# EAGLE design testbench (EAGLE 6.6.0)
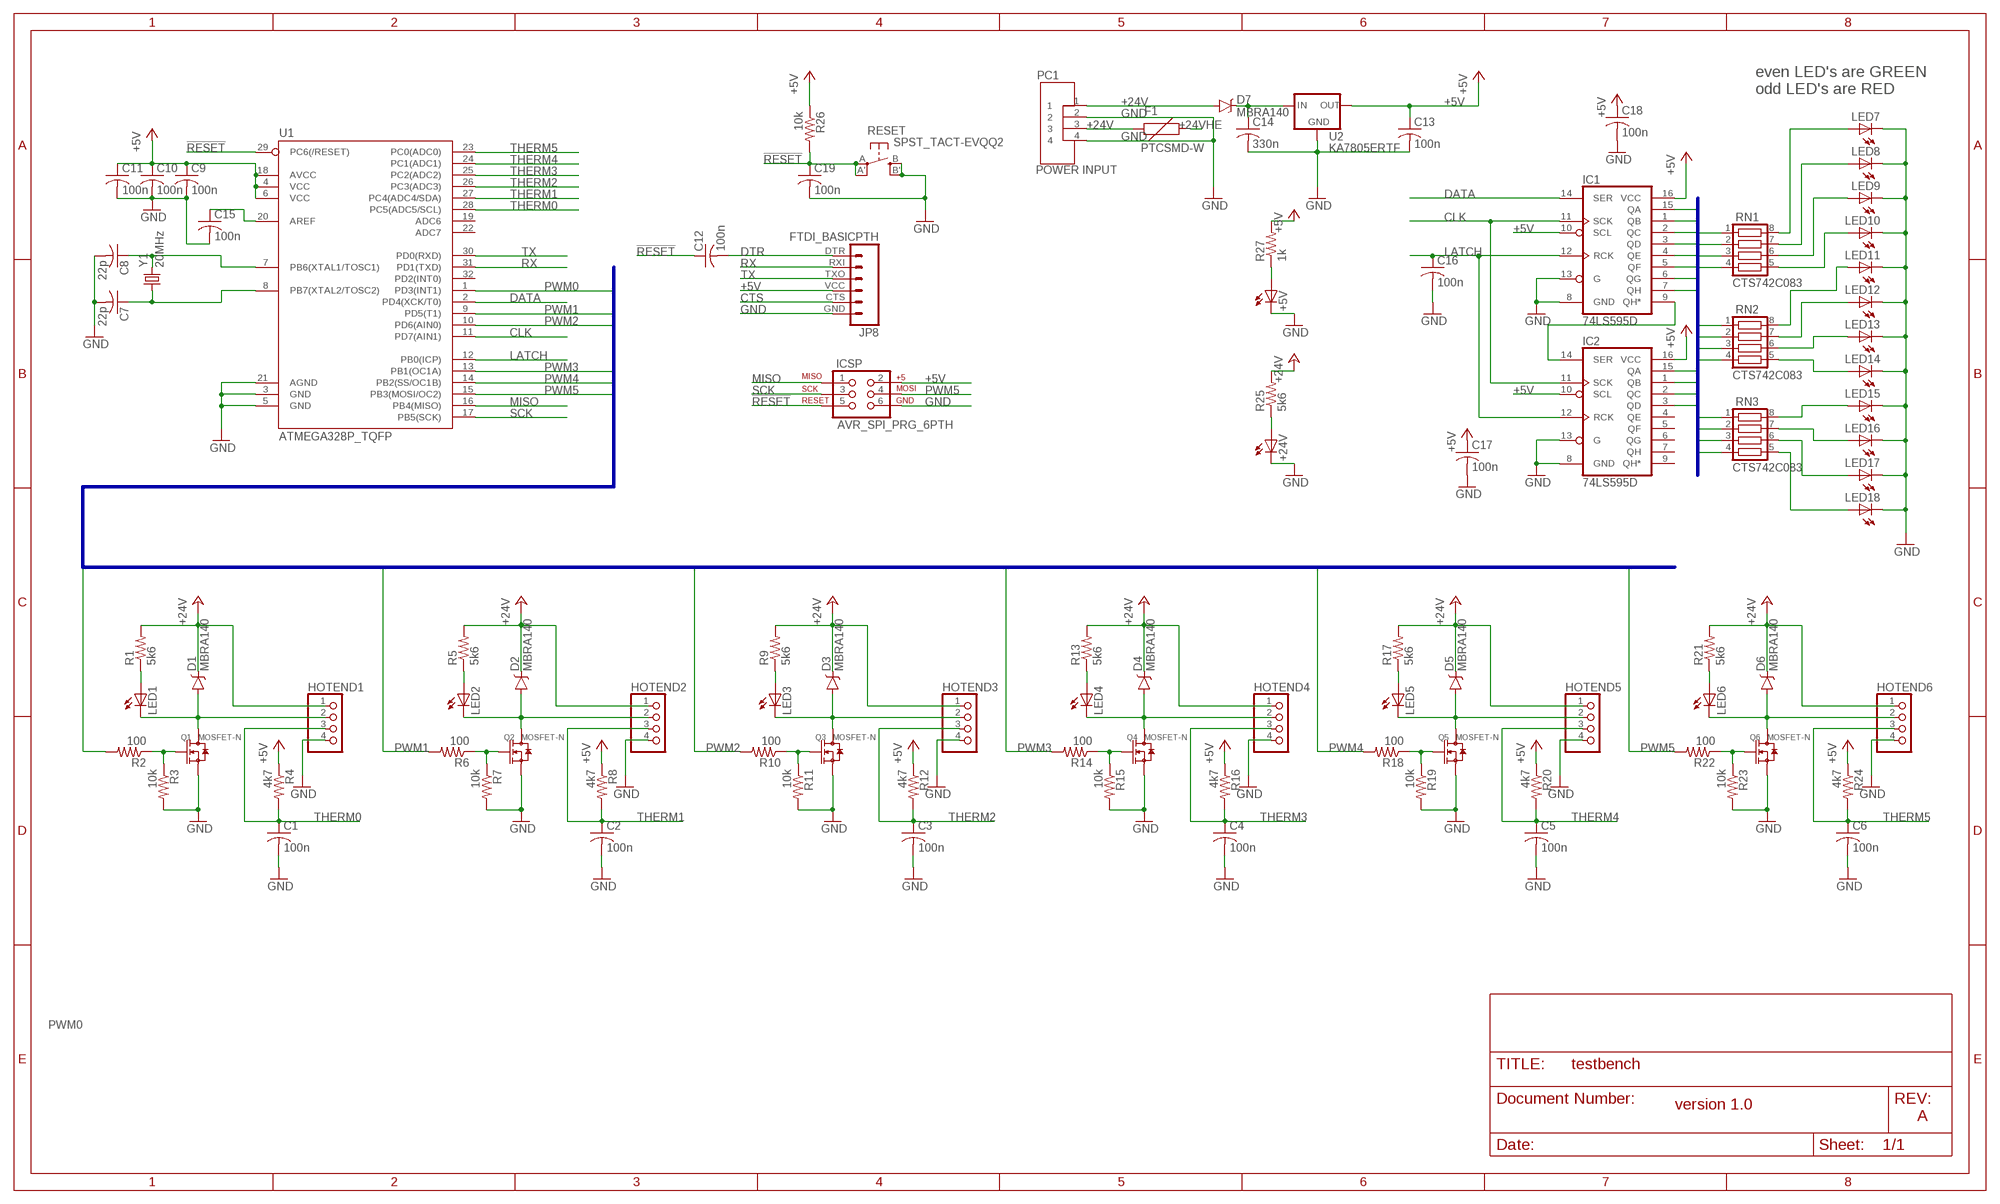
[diagram p0: schematic, sheet 1]

## Parts
+5V  LEDCHIP-LED0805  [CHIP-LED0805]
+24V  LEDCHIP-LED0805  [CHIP-LED0805]
C1  100n  C-USC0805K  [C0805K]
C2  100n  C-USC0805K  [C0805K]
C3  100n  C-USC0805K  [C0805K]
C4  100n  C-USC0805K  [C0805K]
C5  100n  C-USC0805K  [C0805K]
C6  100n  C-USC0805K  [C0805K]
C7  22p  C-USC0805K  [C0805K]
C8  22p  C-USC0805K  [C0805K]
C9  100n  C-USC0805K  [C0805K]
C10  100n  C-USC0805K  [C0805K]
C11  100n  C-USC0805K  [C0805K]
C12  100n  C-USC0805K  [C0805K]
C13  100n  C-USC0805K  [C0805K]
C14  330n  C-USC0805K  [C0805K]
C15  100n  C-USC0805K  [C0805K]
C16  100n  C-USC0805K  [C0805K]
C17  100n  C-USC0805K  [C0805K]
C18  100n  C-USC0805K  [C0805K]
C19  100n  C-USC0805K  [C0805K]
D1  MBRA140  [SMA-DIODE]
D2  MBRA140  [SMA-DIODE]
D3  MBRA140  [SMA-DIODE]
D4  MBRA140  [SMA-DIODE]
D5  MBRA140  [SMA-DIODE]
D6  MBRA140  [SMA-DIODE]
D7  MBRA140  [SMA-DIODE]
F1  PTCSMD-W  [PTC-1206-WIDE]
HOTEND1  PINHD-1X4  [1X04]
HOTEND2  PINHD-1X4  [1X04]
HOTEND3  PINHD-1X4  [1X04]
HOTEND4  PINHD-1X4  [1X04]
HOTEND5  PINHD-1X4  [1X04]
HOTEND6  PINHD-1X4  [1X04]
IC1  74LS595D  [SO16]
IC2  74LS595D  [SO16]
ICSP  AVR_SPI_PRG_6PTH  [2X3]
JP8  FTDI_BASICPTH  [FTDI_BASIC]
LED1  LEDCHIP-LED0805  [CHIP-LED0805]
LED2  LEDCHIP-LED0805  [CHIP-LED0805]
LED3  LEDCHIP-LED0805  [CHIP-LED0805]
LED4  LEDCHIP-LED0805  [CHIP-LED0805]
LED5  LEDCHIP-LED0805  [CHIP-LED0805]
LED6  LEDCHIP-LED0805  [CHIP-LED0805]
LED7  LEDCHIP-LED0805  [CHIP-LED0805]
LED8  LEDCHIP-LED0805  [CHIP-LED0805]
LED9  LEDCHIP-LED0805  [CHIP-LED0805]
LED10  LEDCHIP-LED0805  [CHIP-LED0805]
LED11  LEDCHIP-LED0805  [CHIP-LED0805]
LED12  LEDCHIP-LED0805  [CHIP-LED0805]
LED13  LEDCHIP-LED0805  [CHIP-LED0805]
LED14  LEDCHIP-LED0805  [CHIP-LED0805]
LED15  LEDCHIP-LED0805  [CHIP-LED0805]
LED16  LEDCHIP-LED0805  [CHIP-LED0805]
LED17  LEDCHIP-LED0805  [CHIP-LED0805]
LED18  LEDCHIP-LED0805  [CHIP-LED0805]
PC1  POWER INPUT  POWER_CONNECTOR_4WAY  [MOLEX_MINIFIT-JR]
Q1  MOSFET-N  [SOIC8]
Q2  MOSFET-N  [SOIC8]
Q3  MOSFET-N  [SOIC8]
Q4  MOSFET-N  [SOIC8]
Q5  MOSFET-N  [SOIC8]
Q6  MOSFET-N  [SOIC8]
R1  5k6  R-US_R0805  [R0805]
R2  100  R-US_R0805  [R0805]
R3  10k  R-US_R0805  [R0805]
R4  4k7  R-US_R0805  [R0805]
R5  5k6  R-US_R0805  [R0805]
R6  100  R-US_R0805  [R0805]
R7  10k  R-US_R0805  [R0805]
R8  4k7  R-US_R0805  [R0805]
R9  5k6  R-US_R0805  [R0805]
R10  100  R-US_R0805  [R0805]
R11  10k  R-US_R0805  [R0805]
R12  4k7  R-US_R0805  [R0805]
R13  5k6  R-US_R0805  [R0805]
R14  100  R-US_R0805  [R0805]
R15  10k  R-US_R0805  [R0805]
R16  4k7  R-US_R0805  [R0805]
R17  5k6  R-US_R0805  [R0805]
R18  100  R-US_R0805  [R0805]
R19  10k  R-US_R0805  [R0805]
R20  4k7  R-US_R0805  [R0805]
R21  5k6  R-US_R0805  [R0805]
R22  100  R-US_R0805  [R0805]
R23  10k  R-US_R0805  [R0805]
R24  4k7  R-US_R0805  [R0805]
R25  5k6  R-US_R0805  [R0805]
R26  10k  R-US_R0805  [R0805]
R27  1k  R-US_R0805  [R0805]
RESET  SPST_TACT-EVQQ2  [EVQ-Q2]
RN1  CTS742C083  [CTS742C083]
RN2  CTS742C083  [CTS742C083]
RN3  CTS742C083  [CTS742C083]
U1  ATMEGA328P_TQFP  [TQFP32-08]
U2  KA7805ERTF  V_REG_78XX7812  [TO-252]
Y1  20MHz  CRYSTALHC49US  [HC49US]

## Nets
!RESET: C12.1 C19.1 ICSP.5 R26.2 RESET.A'(P1) RESET.A(P) U1.29(PC6(/RESET))
+5V: C9.1 C10.1 C11.1 C13.1 C17.1 C18.1 IC1.10(SCL) IC1.16(VCC) IC2.10(SCL) IC2.16(VCC) ICSP.2 JP8.VCC R4.1 R8.1 R12.1 R16.1 R20.1 R24.1 R26.1 R27.2 U1.4(VCC) U1.6(VCC) U1.18(AVCC) U2.2(OUT)
+24V: D7.A F1.1 PC1.1 PC1.3 R25.2
+24VHE: D1.C D2.C D3.C D4.C D5.C D6.C F1.2 HOTEND1.1 HOTEND2.1 HOTEND3.1 HOTEND4.1 HOTEND5.1 HOTEND6.1 R1.2 R5.2 R9.2 R13.2 R17.2 R21.2 ; supply symbol labelled +24V
CLK: IC1.11(SCK) IC2.11(SCK) U1.11(PD7(AIN1))
CTS: JP8.CTS
DATA: IC1.14(SER) U1.2(PD4(XCK/T0))
DTR: C12.2 JP8.DTR
GND: +5V.C +24V.C C1.2 C2.2 C3.2 C4.2 C5.2 C6.2 C7.2 C8.2 C9.2 C10.2 C11.2 C13.2 C14.2 C15.2 C16.2 C17.2 C18.2 C19.2 HOTEND1.4 HOTEND2.4 HOTEND3.4 HOTEND4.4 HOTEND5.4 HOTEND6.4 IC1.8(GND) IC1.13(G) IC2.8(GND) IC2.13(G) ICSP.6 JP8.GND LED7.C LED8.C LED9.C LED10.C LED11.C LED12.C LED13.C LED14.C LED15.C LED16.C LED17.C LED18.C PC1.2 PC1.4 Q1.1(S) Q1.2(S) Q1.3(S) Q2.1(S) Q2.2(S) Q2.3(S) Q3.1(S) Q3.2(S) Q3.3(S) Q4.1(S) Q4.2(S) Q4.3(S) Q5.1(S) Q5.2(S) Q5.3(S) Q6.1(S) Q6.2(S) Q6.3(S) R3.2 R7.2 R11.2 R15.2 R19.2 R23.2 RESET.B'(S1) RESET.B(S) U1.3(GND) U1.5(GND) U1.21(AGND) U2.3(GND)
H1: D1.A HOTEND1.2 LED1.C Q1.5(D) Q1.6(D) Q1.7(D) Q1.8(D)
H2: D2.A HOTEND2.2 LED2.C Q2.5(D) Q2.6(D) Q2.7(D) Q2.8(D)
H3: D3.A HOTEND3.2 LED3.C Q3.5(D) Q3.6(D) Q3.7(D) Q3.8(D)
H4: D4.A HOTEND4.2 LED4.C Q4.5(D) Q4.6(D) Q4.7(D) Q4.8(D)
H5: D5.A HOTEND5.2 LED5.C Q5.5(D) Q5.6(D) Q5.7(D) Q5.8(D)
H6: D6.A HOTEND6.2 LED6.C Q6.5(D) Q6.6(D) Q6.7(D) Q6.8(D)
LATCH: C16.1 IC1.12(RCK) IC2.12(RCK) U1.12(PB0(ICP))
LED0: IC1.15(QA) RN2.4
LED1: IC1.1(QB) RN2.3
LED2: IC1.2(QC) RN2.2
LED3: IC1.3(QD) RN2.1
LED4: IC1.4(QE) RN1.4
LED5: IC1.5(QF) RN1.3
LED6: IC1.6(QG) RN1.2
LED7: IC1.7(QH) RN1.1
LED8: IC2.15(QA) RN3.4
LED9: IC2.1(QB) RN3.3
LED10: IC2.2(QC) RN3.2
LED11: IC2.3(QD) RN3.1
MISO: ICSP.1 U1.16(PB4(MISO))
N$1: Q1.4(G) R2.1 R3.1
N$2: +24V.A R25.1
N$3: LED1.A R1.1
N$4: Q5.4(G) R18.1 R19.1
N$5: C7.1 U1.8(PB7(XTAL2/TOSC2)) Y1.1
N$6: LED7.A RN1.8
N$8: Q2.4(G) R6.1 R7.1
N$10: LED2.A R5.1
N$11: Q3.4(G) R10.1 R11.1
N$13: LED3.A R9.1
N$14: Q4.4(G) R14.1 R15.1
N$16: LED4.A R13.1
N$17: LED5.A R17.1
N$18: Q6.4(G) R22.1 R23.1
N$20: LED6.A R21.1
N$21: C8.1 U1.7(PB6(XTAL1/TOSC1)) Y1.2
N$22: C15.1 U1.20(AREF)
N$23: C14.1 D7.C U2.1(IN)
N$24: LED8.A RN1.7
N$25: LED9.A RN1.6
N$26: LED10.A RN1.5
N$27: LED11.A RN2.8
N$28: LED12.A RN2.7
N$29: LED13.A RN2.6
N$30: LED14.A RN2.5
N$31: LED15.A RN3.8
N$32: LED16.A RN3.7
N$33: LED17.A RN3.6
N$34: LED18.A RN3.5
N$35: IC1.9(QH*) IC2.14(SER)
N$36: +5V.A R27.1
PWM0: R2.2 U1.1(PD3(INT1))
PWM1: R6.2 U1.9(PD5(T1))
PWM2: R10.2 U1.10(PD6(AIN0))
PWM3: R14.2 U1.13(PB1(OC1A))
PWM4: R18.2 U1.14(PB2(SS/OC1B))
PWM5: ICSP.4 R22.2 U1.15(PB3(MOSI/OC2))
RX: JP8.RXI U1.31(PD1(TXD))
SCK: ICSP.3 U1.17(PB5(SCK))
THERM0: C1.1 HOTEND1.3 R4.2 U1.28(PC5(ADC5/SCL))
THERM1: C2.1 HOTEND2.3 R8.2 U1.27(PC4(ADC4/SDA))
THERM2: C3.1 HOTEND3.3 R12.2 U1.26(PC3(ADC3))
THERM3: C4.1 HOTEND4.3 R16.2 U1.25(PC2(ADC2))
THERM4: C5.1 HOTEND5.3 R20.2 U1.24(PC1(ADC1))
THERM5: C6.1 HOTEND6.3 R24.2 U1.23(PC0(ADC0))
TX: JP8.TXO U1.30(PD0(RXD))
Unconnected: IC2.4(QE) IC2.5(QF) IC2.6(QG) IC2.7(QH) IC2.9(QH*) U1.19(ADC6) U1.22(ADC7) U1.32(PD2(INT0))

## Buses
PWM[0..5]
LED[0..11]

## Notes on the sheet
- even LED's are GREEN
  odd LED's are RED
- version 1.0
- A

## Library data of the parts
+5V +24V LED1-LED18 = led:LED: LED OSRAM: - CHIPLED LG R971, LG N971, LY N971, LG Q971, LY Q971, LO R971, LY R971 LH N974, LH R974 LS Q976, LO Q976, LY Q976 LO Q996 - Hyper CHIPLED LW Q18S LB Q993, LB Q99A, LB R99A - SideLED LS A670, LO A670, LY A670, LG A670, LP A670 LB A673, LV A673, LT A673, LW A673 LH A674 LY A675 LS A676, LA A676, LO A676, LY A676, LW A676 LS A679, LY A679, LG A679 - Hyper Micro SIDELED® LS Y876, LA Y876, LO Y876, LY Y876 LT Y87S - SmartLED LW L88C, LW L88S LB L89C, LB L89S, LG L890 LS L89K, LO L89K, LY L89K LS L896, LA L896, LO L896, LY L896 - TOPLED LS T670, LO T670, LY T670, LG T670, LP T670 LSG T670, LSP T670, LSY T670, LOP T670, LYG T670 LG T671, LOG T671, LSG T671 LB T673, LV T673, LT T673, LW T673 LH T674 LS T676, LA T676, LO T676, LY T676, LB T676, LH T676, LSB T676, LW T676 LB T67C, LV T67C, LT T67C, LS T67K, LO T67K, LY T67K, LW E67C LS E67B, LA E67B, LO E67B, LY E67B, LB E67C, LV E67C, LT E67C LW T67C LS T679, LY T679, LG T679 LS T770, LO T770, LY T770, LG T770, LP T770 LB T773, LV T773, LT T773, LW T773 LH T774 LS E675, LA E675, LY E675, LS T675 LS T776, LA T776, LO T776, LY T776, LB T776 LHGB T686 LT T68C, LB T68C - Hyper Mini TOPLED® LB M676 - Mini TOPLED Santana® LG M470 LS M47K, LO M47K, LY M47K Source: http://www.osram.convergy.de LUXEON: - LUMILED® LXK2-PW12-R00, LXK2-PW12-S00, LXK2-PW14-U00, LXK2-PW14-V00 LXK2-PM12-R00, LXK2-PM12-S00, LXK2-PM14-U00 LXK2-PE12-Q00, LXK2-PE12-R00, LXK2-PE12-S00, LXK2-PE14-T00, LXK2-PE14-U00 LXK2-PB12-K00, LXK2-PB12-L00, LXK2-PB12-M00, LXK2-PB14-N00, LXK2-PB14-P00, LXK2-PB14-Q00 LXK2-PR12-L00, LXK2-PR12-M00, LXK2-PR14-Q00, LXK2-PR14-R00 LXK2-PD12-Q00, LXK2-PD12-R00, LXK2-PD12-S00 LXK2-PH12-R00, LXK2-PH12-S00 LXK2-PL12-P00, LXK2-PL12-Q00, LXK2-PL12-R00 Source: www.luxeon.com KINGBRIGHT: KA-3528ASYC Source: www.kingbright.com; MF: MULTICOMP; MPN: OVS-0803; OC_FARNELL: 1716765
C1-C6 C9-C13 C15-C19 = rcl:C-US: CAPACITOR, American symbol; MF: AVX; MPN: 08051C104KAT2A; OC_FARNELL: 1740681
C7 C8 = rcl:C-US: CAPACITOR, American symbol; MF: AVX; MPN: 08051A220JAT2A; OC_FARNELL: 317500
C14 = rcl:C-US: CAPACITOR, American symbol; MF: AVX; MPN: 08055C334KAT2A; OC_FARNELL: 1657934
D1-D7 = SparkFun-DiscreteSemi:MBRA140: 40V, 1A Schottky rectifier SMA/DO-214AC package DIO-08053; MF: DIODES INC.; MPN: B140-13-F; OC_FARNELL: 1843670; PROD_ID: DIO-08053
F1 = SparkFun-PowerIC:PTC: Resettable Fuse PTC Resettable Fuse. Spark Fun Electronics SKU : COM-08357; MF: SCHURTER; MPN: 3413.0329.22; OC_FARNELL: 1829472
HOTEND1-HOTEND6 = pinhead:PINHD-1X4: PIN HEADER; OC_FARNELL: unknown
IC1 IC2 = SparkFun-DigitalIC:74*595: 8-bit SHIFT REGISTER, output latch; MF: TEXAS INSTRUMENTS; MPN: SN74AHCT595D; OC_FARNELL: 1740114; PROD_ID: IC-07875
ICSP = SparkFun-Connectors:AVR_SPI_PRG_6: AVR ISP 6 Pin This is the reduced ISP connector for AVR programming. Common on Arduino. This footprint will take up less PCB space and can be used with a 10-pin to 6-pin adapter such as SKU: BOB-08508 **Special note about "TEST_POINT" package. The stop mask is on the top side, so if you want your programming test points to be on the bottom of your board, make sure to place this package on the bottom side of the board. This also ensure that the orientation to program from the bottom side will be correct.; OC_FARNELL: unknown
JP8 = SparkFun-Connectors:FTDI_BASIC: FTDI Basic header with labels; OC_FARNELL: unknown
PC1 = MarcEagleParts:POWER_CONNECTOR_4WAY: MOLEX Mini-Fit Jr. 13A/600V Power connector REF: 39303045 Farnell --> 9963553; MF: MOLEX; MPN: 39303045; OC_FARNELL: 9963553
Q1-Q6 = MarcEagleParts:MOSFET-N: CJ2302：SMD MOSFET N-CH 20V-2.1A; MF: INTERNATIONAL RECTIFIER; MPN: IRF8736PBF; OC_FARNELL: 1551903
R1 R5 R9 R13 R17 R21 R25 = rcl:R-US_: RESISTOR, American symbol; MF: MULTICOMP; MPN: MCWR08X5601FTL; OC_FARNELL: 2447693
R2 R6 R10 R14 R18 R22 = rcl:R-US_: RESISTOR, American symbol; MF: PANASONIC ELECTRONIC COMPONENTS; MPN: ERA6AEB101V; OC_FARNELL: 1577644
R3 R7 R11 R15 R19 R23 R26 = rcl:R-US_: RESISTOR, American symbol; MF: BOURNS; MPN: 0621-013K500-AB103; OC_FARNELL: 2469474
R4 R8 R12 R16 R20 R24 = rcl:R-US_: RESISTOR, American symbol; MF: TE CONNECTIVITY; MPN: 1-2176085-7; OC_FARNELL: 2118118
R27 = rcl:R-US_: RESISTOR, American symbol; MF: BOURNS; MPN: CR0805-JW-102ELF; OC_FARNELL: 2008389
RESET = adafruit:SPST_TACT: SMT 6mm switch, EVQQ2 series http://www.ladyada.net/library/eagle; MF: PANASONIC ELECTRONIC COMPONENTS; MPN: EVQQ2503W; OC_FARNELL: 9962913
RN1-RN3 = resistor-net:CTS742C083: Chip Resistor Array 4 Single Resistor Source: http://www.ctscorp.com/components/Datasheets/CTSChipArrayDs.pdf; OC_FARNELL: unknown; OC_NEWARK: unknown
U1 = SparkFun-DigitalIC:ATMEGA328P_TQFP; MF: ATMEL; MPN: ATMEGA328-AU; OC_FARNELL: 1972086; PROD_ID: IC-09069
U2 = SparkFun-PowerIC:V_REG_78XX: Voltage Regulator Standard 78xx regulator. IGO (Input Ground Output). Spark Fun Electronics SKU : COM-00107; MF: FAIRCHILD SEMICONDUCTOR; MPN: KA7805ERTF; OC_FARNELL: 2102585; PROD_ID: VREG-12370; VALUE: +12v
Y1 = SparkFun-FreqCtrl:CRYSTAL: Various standard crystals. Proven footprints.; MF: TXC; MPN: 9B-20.000MAAJ-B; OC_FARNELL: 1842224

## Board
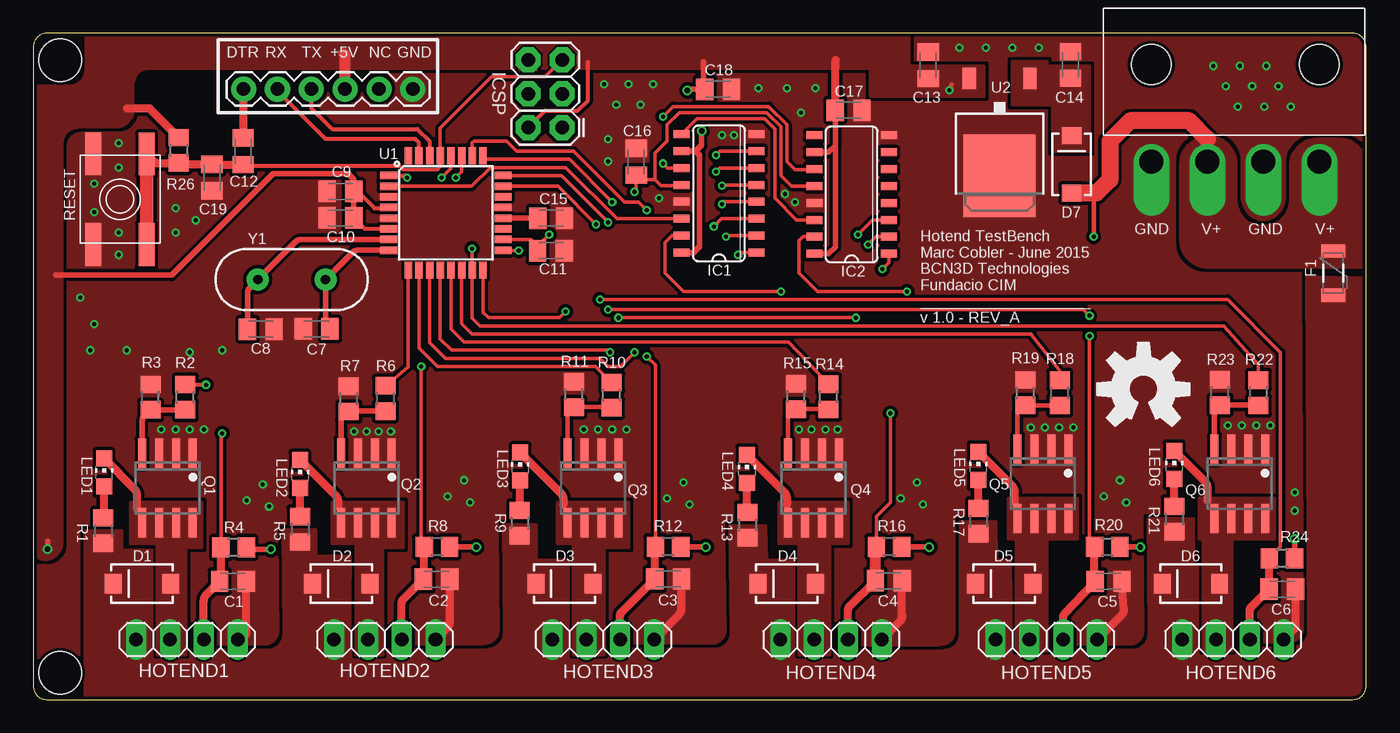
[diagram p1: board, top side]
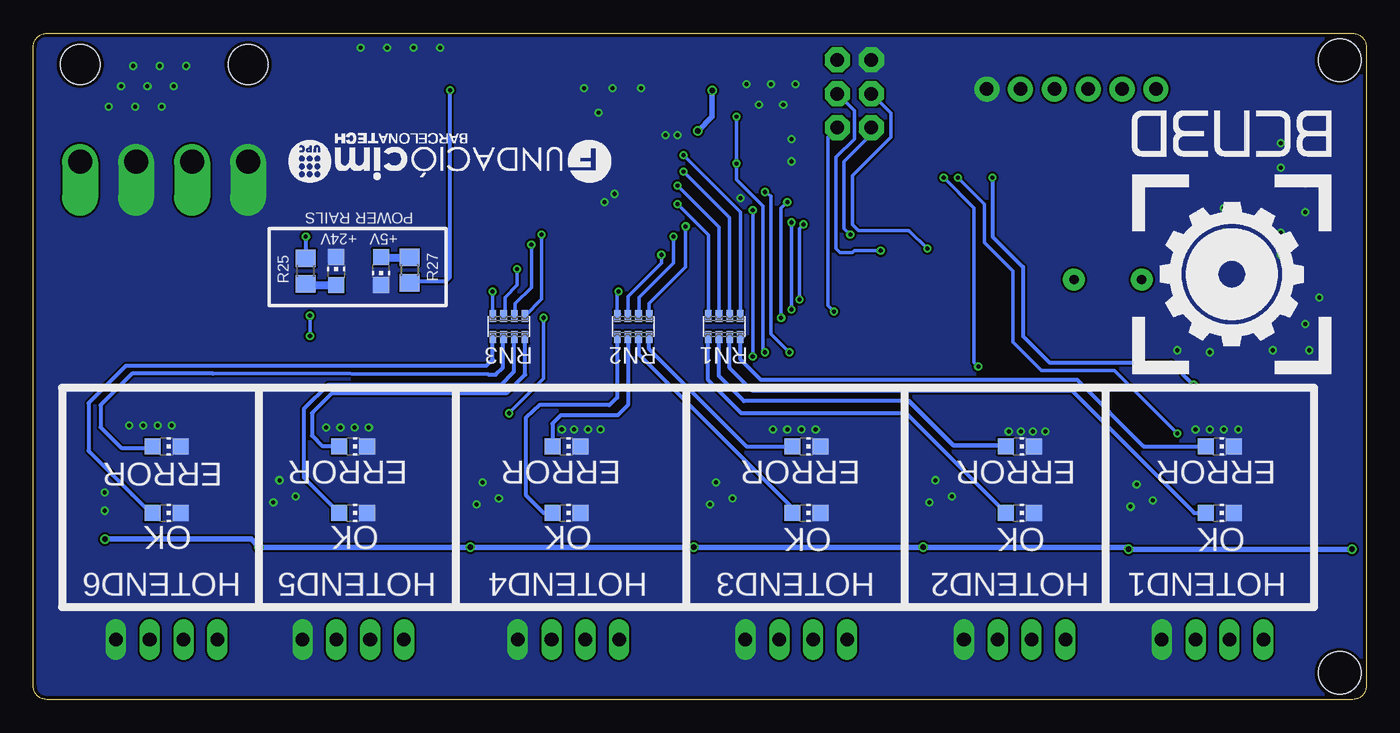
[diagram p2: board, bottom side, seen from below]

Size 100 x 50 mm. Coordinates in mm from the lower left corner, seen from the top.
Outline: 1,0 99,0 arc90 100,1 100,49 arc90 99,50 1,50 arc90 0,49 0,1 arc90 1,0
Copper layers (1*16): Top 0.035mm / dielectric 1.5mm / Bottom 0.035mm
Design rules "ITEADstudio_DRC": minimum track width 6mil, minimum drill 12mil, track to track 6mil, track to pad 6mil, pad to pad 6mil, via to via 6mil, smd to smd 0mil, copper to edge 10mil, drill to drill 10mil, minimum pad ring 10mil, minimum via ring 6mil, stop-mask expansion 2mil, vias tented up to drill 100mil, thermal gap 10mil
Holes 3.2 mm at 2,48 2,2

### Footprints (pad centres in the part's own frame; a part is rotated, then mirrored left to right if it is on the bottom)
CHIP-LED0805 = smd 1.2 x 1.2: A 0,-1.05; C 0,1.05
C0805K = smd 1.3 x 1.6: 1 -1,0; 2 1,0
SMA-DIODE = smd 1.27 x 1.47: A -2.15,0; C 2.15,0
PTC-1206-WIDE = smd 1 x 1.8: 1 -1.654,0; 2 1.654,0
1X04 = drill 1.016 long: 1 -3.81,0; 2 -1.27,0; 3 1.27,0; 4 3.81,0
SO16 = smd 0.6 x 1.2: 1 -4.445,-2.8; 2 -3.175,-2.8; 3 -1.905,-2.8; 4 -0.635,-2.8; 5 0.635,-2.8; 6 1.905,-2.8; 7 3.175,-2.8; 8 4.445,-2.8; 9 4.445,2.8; 10 3.175,2.8; 11 1.905,2.8; 12 0.635,2.8; 13 -0.635,2.8; 14 -1.905,2.8; 15 -3.175,2.8; 16 -4.445,2.8
2X3 = drill 1.016 pad 1.88 octagon: 1 0,0; 2 0,2.54; 3 2.54,0; 4 2.54,2.54; 5 5.08,0; 6 5.08,2.54
FTDI_BASIC = drill 1.016 pad 1.88: CTS 10.16,0; DTR 0,0; GND 12.7,0; RXI 2.54,0; TXO 5.08,0; VCC 7.62,0
MOLEX_MINIFIT-JR = drill 1.8 offset: 1 0,7.3; 2 4.2,7.3; 3 8.4,7.3; 4 12.6,7.3 | hole 3: 0,0; 12.6,0
SOIC8 = smd 0.6 x 2.2: 1 -1.905,-2.6; 2 -0.635,-2.6; 3 0.635,-2.6; 4 1.905,-2.6; 5 1.905,2.6; 6 0.635,2.6; 7 -0.635,2.6; 8 -1.905,2.6
R0805 = smd 1.3 x 1.5: 1 -0.95,0; 2 0.95,0
EVQ-Q2 = smd 3.2 x 1.2: A -3.4,-2; A' 3.4,-2; B -3.4,2; B' 3.4,2
CTS742C083 = smd 0.5 x 0.9: 1 -1.2,-0.8; 2 -0.4,-0.8; 3 0.4,-0.8; 4 1.2,-0.8; 5 1.2,0.8; 6 0.4,0.8; 7 -0.4,0.8; 8 -1.2,0.8
TQFP32-08 = smd 1.27 x 0.559: 1 -4.293,2.8; 2 -4.293,2; 3 -4.293,1.2; 4 -4.293,0.4; 5 -4.293,-0.4; 6 -4.293,-1.2; 7 -4.293,-2; 8 -4.293,-2.8; 17 4.293,-2.8; 18 4.293,-2; 19 4.293,-1.2; 20 4.293,-0.4; 21 4.293,0.4; 22 4.293,1.2; 23 4.293,2; 24 4.293,2.8 | smd 0.559 x 1.27: 9 -2.8,-4.293; 10 -2,-4.293; 11 -1.2,-4.293; 12 -0.4,-4.293; 13 0.4,-4.293; 14 1.2,-4.293; 15 2,-4.293; 16 2.8,-4.293; 25 2.8,4.293; 26 2,4.293; 27 1.2,4.293; 28 0.4,4.293; 29 -0.4,4.293; 30 -1.2,4.293; 31 -2,4.293; 32 -2.8,4.293
TO-252 = smd 1 x 1.6: 1 -2.28,-4.8; 2 2.28,-4.8 | smd 5.4 x 6.2: 3 0,2.5
HC49US = drill 0.7 pad 1.651: 1 -2.54,0; 2 2.54,0

### Placement (x,y rotation side)
+5V  73.91,32.16 180 bottom
+24V  77.27,32.16 0 bottom
C1  14.99,8.87 0 top
C2  30.25,9.03 0 top
C3  47.62,9.05 0 top
C4  64.19,8.92 0 top
C5  80.67,8.87 0 top
C6  93.7,8.28 0 top
C7  21.26,27.81 180 top
C8  17.07,27.79 0 top
C9  23.04,38.13 180 top
C10  23.04,36.14 180 top
C11  38.84,33.68 0 top
C12  15.75,41.15 90 top
C13  67.13,47.6 90 top
C14  77.8,47.62 90 top
C15  38.86,36.12 0 top
C16  45.24,40.36 90 top
C17  61.16,44.22 0 top
C18  51.38,45.8 0 top
C19  13.41,39.17 270 top
D1  8.14,8.7 180 top
D2  23.11,8.7 180 top
D3  39.86,8.7 180 top
D4  56.52,8.7 180 top
D5  72.83,8.7 180 top
D6  86.85,8.7 180 top
D7  77.9,40.16 90 top
F1  97.54,32 270 top
HOTEND1  11.52,4.5 0 top
HOTEND2  26.37,4.5 0 top
HOTEND3  42.76,4.5 0 top
HOTEND4  59.85,4.5 0 top
HOTEND5  76,4.5 0 top
HOTEND6  90,4.5 0 top
IC1  51.44,37.99 90 top
IC2  61.39,37.9 90 top
ICSP  39.67,42.93 90 top
JP8  15.77,45.82 0 top
LED1  5.31,17.03 0 top
LED2  20.02,16.93 0 top
LED3  36.53,17.48 0 top
LED4  53.54,17.31 0 top
LED5  70.89,17.54 0 top
LED6  85.6,17.62 0 top
LED7  11,19 270 bottom
LED8  11,14 270 bottom
LED9  26,19 270 bottom
LED10  26,14 270 bottom
LED11  42,19 270 bottom
LED12  42,14 270 bottom
LED13  60,19 270 bottom
LED14  60,14 270 bottom
LED15  76,19 270 bottom
LED16  76,14 270 bottom
LED17  90,19 270 bottom
LED18  90,14 270 bottom
PC1  96.49,47.67 180 top
Q1  10.07,15.88 180 top
Q2  24.99,15.88 180 top
Q3  41.99,15.88 180 top
Q4  58.52,15.88 180 top
Q5  75.74,16.19 180 top
Q6  90.53,16.19 180 top
R1  5.26,12.68 270 top
R2  11.4,22.69 90 top
R3  8.79,22.69 90 top
R4  15.04,11.41 180 top
R5  20.02,12.79 270 top
R6  26.42,22.59 90 top
R7  23.67,22.56 90 top
R8  30.28,11.46 180 top
R9  36.5,13.24 270 top
R10  43.38,22.84 90 top
R11  40.56,22.89 90 top
R12  47.62,11.46 180 top
R13  53.57,13.09 270 top
R14  59.66,22.72 90 top
R15  57.23,22.74 90 top
R16  64.21,11.46 180 top
R17  70.92,13.4 270 top
R18  77.01,23.02 90 top
R19  74.42,23.03 90 top
R20  80.57,11.44 180 top
R21  85.6,13.55 270 top
R22  91.92,23.02 90 top
R23  89.03,23.05 90 top
R24  93.68,10.59 180 top
R25  79.55,32.16 90 bottom
R26  10.92,41.22 270 top
R27  71.78,32.23 270 bottom
RESET  6.5,37.54 90 top
RN1  48.15,28 180 bottom
RN2  55,28 180 bottom
RN3  64.31,28 180 bottom
U1  30.94,36.53 0 top
U2  72.49,41.81 180 top
U$1  [FCIM_LOGO]  54.84,46.16 180 bottom
U$2  [BCN3D_LOGO]  2.61,44.19 180 bottom
U$3  [OSHW-LOGO-L]  83.29,23.3 0 top
Y1  16MHz  [HC49US]  19.38,31.52 180 top

### Tracks (layer width: path | path; a pad name or v marks a point on that pad's centre or on a via)
!RESET
  Top 0.254: ICSP.5 38.41,46.74 34.39,46.74 30.54,42.88 U1.29 30.54,39.99 30.33,39.78 27.74,39.78 27.43,40.08
  Top 0.305: C19.1 13.5,40.08 | C12.1 15.81,40.08 27.43,40.08
  Top 0.61: 13.5,40.08 13.56,40.15 C12.1 | RESET.A' 9.17,40.27 R26.2 | 11.05,40.17 C19.1
  Top 0.813: R26.2 11.05,40.17
  Top 1.016: RESET.A RESET.A'
+5V  (via drill 0.3, 0.41)
  Top 0.254: 37.84,34.03 37.34,34.52 U1.18 | v38.71,34.9 37.84,34.03 | 37.84,34.03 C11.1
  Top 0.305: v68.73,45.72 68.89,45.87 68.89,46.18 | 23.9,38.12 C9.1 24.36,38.12 25.6,36.88 26.6,36.88 | C10.1 24.86,35.33 U1.6 | ICSP.2 38.41,44.2 40.84,44.2 41.6,44.96 41.6,47.85
  Top 0.406: 26.6,36.88 U1.4 | 26.61,35.36 U1.6 | R4.1 16.12,11.28 v17.83,11.28 | v1.07,11.28 1.07,11.89 | v33.22,11.43 33.19,11.46 R8.1 | v50.44,11.43 50.41,11.46 R12.1 | v67.21,11.43 67.17,11.46 R16.1 | v83.06,11.43 v83.05,11.44 R20.1 | v94.64,12.04 94.62,12.02 R24.1 | 1.68,31.85 10.36,31.85 17.98,39.47 23.62,39.47 24.04,39.06 C9.1 C10.1 | C17.1 60.16,41.57 | 60.16,41.57 59.67,41.08 IC2.10 | IC2.16 59.67,33.46 60.16,33.95 60.16,41.57 | 50.29,47.85 50.29,45.89 C18.1 49.15,45.8 v49.07,45.72 | IC1.16 49.54,33.54 49.99,33.98 49.99,40.84 49.68,41.15 | 49.68,41.15 49.67,41.16 IC1.10 | 49.68,41.15 50.14,41.6 v50.14,42.67
  Top 0.61: R26.1 8.75,44.35 7.01,44.35 | C17.1 60.2,44.26 60.2,48.01
  Top 0.813: JP8.VCC 23.39,48.39 23.32,48.46
  Bottom 0.254: ICSP.2 37.13,42.42 39.17,40.39 39.17,35.36 v38.71,34.9
  Bottom 0.305: R27.2 71.67,31.39 69.04,31.39 68.73,31.7 v68.73,45.72
  Bottom 0.406: v1.07,11.28 v17.83,11.28 17.98,11.43 v33.22,11.43 v50.44,11.43 v67.21,11.43 v83.06,11.43 83.67,12.04 v94.64,12.04 | v50.14,42.67 49.07,43.74 v49.07,45.72
  pour Top (no thermals): 71.32,47.55 71.32,45.26 62.79,45.26 62.79,47.55
  pour Top: 65.68,47.4 65.68,49.99 3.96,49.99 3.96,47.29 arc-90 2.69,46.02 0,46.02 0,11.38 arc90 0.86,10.52 arc90 2.13,11.79 2.13,41.71 arc-90 3.4,42.98 6.2,42.98 arc90 7.47,44.25 7.47,46.13 arc-90 8.74,47.4
+24V  (via drill 0.3)
  Top 0.356: v79.55,34.75 79.55,38.01 79.77,38.01
  Top 1.27: 88.08,42.06 86.72,43.43 82.3,43.43 80.77,41.91 80.77,39.01 79.77,38.01 D7.A
  Bottom 0.305: v79.55,34.75 R25.2
  pour Top (no thermals): 99.97,32.46 99.97,40.06 arc90 97.97,42.06 96.34,42.06 arc90 94.34,40.06 94.34,37.51 arc-90 92.34,35.51 92.22,35.51 arc-90 90.22,37.51 90.22,40.21 arc90 88.22,42.21 88.11,42.21 arc90 86.11,40.21 86.11,34.46 arc90 88.11,32.46
+24VHE
  Top 0.305: 56.08,4.39 HOTEND4.1 | 56.03,4.35 HOTEND4.1 | 56.08,4.45 HOTEND4.1
  pour Top (rank 2, no thermals): 100,31.63 100.42,1.16 arc-89 99.42,0.18 3.89,-0.23 3.89,12.66 6.63,12.66 6.63,11.21 8.92,11.21 8.92,3.68 17.54,3.68 arc90 18.81,4.96 18.75,12.73 21.18,12.73 21.18,10.75 23.77,10.75 23.7,3.68 34.08,3.74 arc90 35.35,5.02 35.28,13.12 37.72,13.12 37.72,10.45 40.23,10.45 40.23,3.75 51.11,3.75 arc91 52.38,5.04 52.27,13.04 54.94,13.04 55.02,10.45 57.15,10.45 57.3,3.6 68.31,3.67 arc90 69.57,4.94 69.57,13.34 72.21,13.34 72.24,10.45 73.3,10.45 73.38,3.75 82.45,3.69 arc91 83.73,4.96 83.67,13.56 87.02,13.56 87.02,10.06 87.33,10.06 87.33,3.81 94.45,3.88 arc89 95.71,5.15 95.55,31.7
CLK  (via drill 0.3)
  Top 0.254: U1.11 29.74,26.8 30.94,25.6 42.52,25.6 43.13,24.99 44.04,24.99 v45.11,26.06 | IC2.11 58.56,39.78 57.15,39.78 56.54,40.39 56.54,43.13 55.17,44.5 48.01,44.5 v47.24,43.74 | v47.24,40.23 47.59,39.89 IC1.11
  Bottom 0.254: v45.11,26.06 45.26,26.21 45.26,37.03 47.24,39.01 v47.24,40.23 v47.24,43.74
DATA
  Top 0.254: 48.61,36.12 IC1.14 43.78,36.08 39.93,39.93 34.29,39.93 32.89,38.52 U1.2
DTR
  Top 0.61: C12.2 15.77,42.17 JP8.DTR
GND  (via drill 0.3)
  Top 0.305: Q5.1 77.65,18.07 77.95,17.76 | 92.45,19.44 Q6.1
  Top 0.61: HOTEND1.4 15.35,4.5 arc90 15.99,5.13 C1.2 | HOTEND2.4 31.07,5.38 arc45 31.25,5.83 C2.2 | HOTEND3.4 48.44,6.37 arc45 48.62,6.82 C3.2 | HOTEND4.4 65,5.84 arc45 65.19,6.29 C4.2 | HOTEND5.4 81.64,6.33 arc45 81.82,6.78 C5.2 | HOTEND6.4 94.61,5.3 arc45 94.7,5.52 C6.2
  other vias: 56.54,45.87 54.41,45.87 58.67,45.87 57.61,44.04 57.15,37.34 51.66,42.37 52.58,42.37 42.82,46.18 44.65,46.18 46.48,46.18 45.57,44.65 43.74,44.65 43.13,40.39 43.13,42.06 3.51,30.18 11.73,26.06 14.17,26.21 4.57,28.19 7.01,26.21 4.27,26.21 9.6,20.27 10.67,20.27 11.73,20.27 12.8,20.27 24.08,20.12 24.99,20.12 25.91,20.12 26.82,20.12 41.3,20.27 42.37,20.27 43.43,20.27 44.5,20.27 57.45,20.27 58.37,20.27 59.44,20.27 60.35,20.27 74.83,20.42 75.9,20.42 76.96,20.42 78.03,20.42 89.61,20.57 90.68,20.57 91.74,20.57 92.81,20.57 6.4,33.38 6.4,35.05 4.57,36.58 4.57,38.71 6.4,39.93 6.4,41.76 10.67,35.05 10.67,36.88 12.19,35.97 69.49,48.92 71.48,48.92 73.46,48.92 75.44,48.92 88.54,47.55 92.51,47.55 90.53,47.55 89.46,46.02 93.42,46.02 91.44,46.02 90.37,44.5 94.34,44.5 92.35,44.5 17.22,16.15 16,14.94 17.68,14.48 32.31,16.46 31.09,15.24 32.77,14.78 48.77,16.31 47.55,15.09 49.23,14.63 66.29,16.31 65.07,15.09 66.75,14.63 81.53,16.46 80.31,15.24 81.99,14.78 94.64,15.54 94.64,14.17 56.39,37.95 46.94,37.64
  pour Bottom (no thermals): -0.15,50.29 100.43,50.29 100.43,-0.3 -0.46,-0.3 -0.46,50.29
  pour Top (isolate 0.254, rank 6, no thermals): -0.53,50.44 100.43,50.44 100.43,-0.3 -0.53,-0.3
H1
  Top 0.61: LED1.C 7.59,15.8 arc-45 7.77,15.35 7.77,14.33
  pour Top (no thermals): 11.43,3.35 11.43,11.43 12.65,11.43 12.65,14.78 7.32,14.78 7.32,11.73 9.3,11.73 9.3,3.35
H2
  Top 0.305: 25.77,14.11 Q2.7
  Top 0.406: Q2.8 26.98,14.11
  Top 0.61: LED2.C 22.67,15.32 arc-45 22.86,14.87 22.86,14.48
  pour Top (no thermals): 26.21,3.35 26.21,11.43 27.74,11.43 27.74,14.78 22.4,14.78 22.4,11.73 24.23,11.73 24.23,3.35
H3
  Top 0.61: LED3.C 39.59,15.47 arc-45 39.78,15.02 39.78,14.63
  pour Top (no thermals): 42.82,3.35 42.82,11.43 44.65,11.43 44.65,14.78 39.32,14.78 39.32,11.73 40.54,11.73 40.54,3.35
H4
  Top 0.61: LED4.C 56.35,15.55 arc-45 56.54,15.1 56.54,14.63
  pour Top (no thermals): 59.74,3.35 59.74,11.73 61.11,11.73 61.11,14.78 55.93,14.78 55.93,11.73 57.45,11.73 57.45,3.35
H5
  Top 0.61: LED5.C 73.42,16.05 arc-45 73.61,15.61 73.61,14.78
  pour Top (no thermals): 76.05,3.66 76.05,12.04 78.33,12.04 78.33,15.09 73.15,15.09 73.15,12.04 73.76,12.04 73.76,3.66
H6
  Top 0.61: LED6.C 87.9,16.36 arc-45 88.09,15.92 88.09,14.94
  pour Top (no thermals): 89.92,3.66 89.92,12.04 93.12,12.04 93.12,15.09 87.48,15.09 87.48,12.04 87.78,12.04 87.78,3.66
LATCH  (via drill 0.3)
  Top 0.254: U1.12 30.54,27.07 31.39,26.21 43.13,26.21 v43.28,26.06 | IC1.12 48.58,38.56 47.09,38.56 46.63,39.01 | IC2.12 56.87,38.54 56.08,39.32 56.08,42.98 55.02,44.04 48.46,44.04 47.55,43.13 47.55,41.91 46.63,41 46.63,39.01 | 45.24,38.84 C16.1 | C16.1 45.58,39.01 46.63,39.01 | v45.11,38.1 45.24,38.23 C16.1
  Bottom 0.254: v43.28,26.06 44.65,27.43 44.65,37.8 v45.11,38.1
LED0  (via drill 0.3)
  Top 0.254: IC1.15 47.92,34.81 47.4,34.29 47.4,32 48.77,30.63 v56.08,30.63
  Bottom 0.254: v56.08,30.63 56.2,30.52 RN2.4
  Bottom 0.406: 56.24,28.84 RN2.4 56.08,28.92
LED1  (via drill 0.3)
  Top 0.254: IC1.1 53.05,33.54 v52.88,33.38
  Bottom 0.254: v52.88,33.38 52.88,32.77 55.4,30.25 RN2.3
LED2  (via drill 0.3)
  Top 0.254: IC1.2 52.03,34.81 v51.97,34.75
  Bottom 0.254: v51.97,34.75 51.97,32.77 54.56,30.18 54.56,28.84 RN2.2
  Bottom 0.305: 54.71,28.69 RN2.2
LED3  (via drill 0.3)
  Top 0.254: IC1.3 51.63,36.08 v51.05,35.51
  Bottom 0.254: v51.05,35.51 51.05,32.46 53.8,29.71 RN2.1
LED4  (via drill 0.3)
  Top 0.254: v51.66,37.19 51.83,37.35 IC1.4
  Bottom 0.254: RN1.4 49.35,34.87 v51.66,37.19
LED5  (via drill 0.3)
  Top 0.254: IC1.5 51.73,38.62 v51.66,38.56
  Bottom 0.254: v51.66,38.56 48.55,35.45 RN1.3
LED6  (via drill 0.3)
  Top 0.254: v51.21,39.62 51.47,39.89 IC1.6
  Bottom 0.254: RN1.2 47.75,36.17 v51.21,39.62
LED7  (via drill 0.3)
  Top 0.254: IC1.7 51.52,41.16 v51.21,40.84
  Bottom 0.254: v51.21,40.84 46.95,36.59 RN1.1
LED8  (via drill 0.3)
  Top 0.254: IC2.15 57.74,34.73 57.45,34.44 57.45,32 58.83,30.63 v65.53,30.63
  Bottom 0.254: v65.53,30.63 65.53,28.82 RN3.4
LED9  (via drill 0.3)
  Top 0.254: IC2.1 64.19,32.8 v63.7,32.31
  Bottom 0.254: v63.7,32.31 63.7,31.09 64.62,30.18 64.62,28.9 RN3.3
LED10  (via drill 0.3)
  Top 0.254: IC2.2 63.23,34.73 v62.64,34.14
  Bottom 0.254: v62.64,34.14 62.64,30.94 63.86,29.72 63.86,28.86 RN3.2
LED11  (via drill 0.3)
  Top 0.254: IC2.3 62.97,36 v61.87,34.9
  Bottom 0.254: v61.87,34.9 61.87,30.04 RN3.1
MISO  (via drill 0.3)
  Top 0.254: U1.16 33.74,29.05 34.14,28.65 39.47,28.65 v39.93,29.11
  Bottom 0.254: ICSP.1 40.39,42.22 40.39,29.57 v39.93,29.11
N$1
  Top 0.406: Q1.4 8.16,20.85 arc-45 8.35,21.3 R3.1 R2.1
N$2
  Bottom 0.61: R25.1 79.45,31.11 +24V.A
N$3
  Top 0.61: R1.1 arc45 5.31,13.76 LED1.A
N$4
  Top 0.356: Q5.4 73.84,21.49 R19.1 R18.1
  Top 0.406: 77,21.62 arc-45 R18.1
N$5
  Top 0.406: U1.8 24.39,33.73 arc45 23.94,33.54 Y1.1 21.92,28.42 arc45 22.11,27.97 C7.1
N$6
  Bottom 0.305: 46.79,27.19 RN1.8 46.94,27.19 46.94,25.5 45.44,24 21.72,24 16.71,19 LED7.A
N$8
  Top 0.406: 26.36,21.31 arc45 R6.1 23.7,21.64 R7.1 23.09,21.03 Q2.4
N$10
  Top 0.61: R5.1 LED2.A
N$11
  Top 0.356: Q3.4 40.08,21.46 R11.1 43.33,21.95 R10.1
  Top 0.406: 43.26,21.64 arc-45 R10.1
N$13
  Top 0.61: R9.1 arc45 36.52,14.25 LED3.A
N$14
  Top 0.356: Q4.4 56.62,21.18 R15.1 59.64,21.79 R14.1
  Top 0.406: 59.6,21.49 arc-45 R14.1
N$16
  Top 0.61: R13.1 arc-45 53.54,14.1 LED4.A
N$17
  Top 0.61: R17.1 arc-45 70.89,14.41 LED5.A
N$18
  Top 0.406: Q6.4 88.62,21.27 arc-45 88.81,21.72 R23.1 92.01,22.1 arc-45 R22.1
N$20
  Top 0.61: R21.1 LED6.A
N$21
  Top 0.406: U1.7 20.11,34.52 arc45 19.66,34.34 Y1.2 16.25,30.94 arc45 16.07,30.49 C8.1
N$22
  Top 0.406: U1.20 35.24,36.12 C15.1
N$23
  pour Top (no thermals): 79.25,47.55 76.05,47.55 76.05,47.85 73.46,47.85 73.46,44.65 76.5,44.65 76.5,41.15 79.25,41.15
N$24
  Bottom 0.305: RN1.7 47.75,24.89 46.06,23.2 22.1,23.2 12.89,14 LED8.A | RN1.7
N$25
  Bottom 0.305: RN1.6 48.56,27.19 48.56,24.28 46.69,22.4 34.29,22.4 | 27.13,19.08 LED9.A
  Bottom 0.356: 27.13,19.08 30.96,19.08 34.29,22.4
N$26
  Bottom 0.305: RN1.5 49.38,27.18 49.38,23.98 46.89,21.49 34.54,21.49 LED10.A
N$27
  Bottom 0.305: RN2.8 53.8,26.29 46.51,19 LED11.A
N$28
  Bottom 0.305: RN2.7 54.56,27.16 54.56,25.91 43.05,14.4 LED12.A
N$29
  Bottom 0.305: RN2.6 55.4,22.09 56.16,21.34 60.43,21.34 61.05,20.71 LED13.A
N$30
  Bottom 0.305: RN2.5 56.2,22.67 56.77,22.1 62.03,22.1 63.02,21.18 63.02,15.32 61.7,14 LED14.A
N$31
  Bottom 0.305: RN3.8 63.09,27.18 63.09,24.38 64.47,23.01 77.57,23.01 79.1,21.49 79.1,19.81 78.33,19.05 77.1,19.05 LED15.A 77.11,19.06
N$32
  Bottom 0.305: RN3.7 63.93,27.18 63.93,24.61 64.92,23.62 77.88,23.62 79.7,21.79 79.7,16.66 LED16.A
N$33
  Bottom 0.305: RN3.6 64.77,27.14 64.77,24.92 65.3,24.38 65.84,24.38 86.51,24.46 92.58,24.46 94.94,22.1 94.94,20.42 93.42,18.9 91.15,18.9 LED17.A 90.98,19.07
N$34
  Bottom 0.305: RN3.5 65.53,27.18 65.53,25.53 66.02,25.04 93.07,25.04 95.86,22.25 95.86,18.67 92.58,15.39 92.24,15.05 91.19,14 LED18.A
N$35
  Top 0.254: IC1.9 49.8,43.59 54.86,43.59 55.63,42.82 55.63,37.64 57.27,36 IC2.14
N$36
  Bottom 0.61: +5V.A 73.89,33.18 R27.1
PWM0  (via drill 0.3)
  Top 0.305: U1.1 27.89,39.32 v28.04,39.17 | v12.95,23.62 11.42,23.62 R2.2
  Bottom 0.305: v12.95,23.62 14.63,25.3 23.77,25.3 25.76,27.28 25.76,32.46 28.04,34.75 v28.04,39.17
PWM1
  Top 0.254: U1.9 28.14,24.96 R6.2
PWM2
  Top 0.254: U1.10 28.94,26.38 30.33,24.99 42.18,24.99 R10.2 43.38,23.82
PWM3
  Top 0.254: R14.2 56.66,26.82 32.31,26.82 31.34,27.79 U1.13
PWM4
  Top 0.254: R18.2 77.01,24.64 74.83,27.43 32.92,27.43 32.14,28.21 U1.14 32.16,32.21
PWM5  (via drill 0.3)
  Top 0.254: R22.2 91.9,23.84 91.9,25.15 89.31,28.04 33.53,28.04 32.94,28.63 U1.15 32.94,33.81 v32.92,33.83
  Bottom 0.254: ICSP.4 35.66,43.99 35.66,42.22 38.56,39.32 38.56,35.66 38.1,35.2 34.29,35.2 v32.92,33.83 32.92,33.98
RX
  Top 0.305: JP8.RXI 18.31,45.7 21.41,42.6 21.79,42.22 21.95,42.06 28.65,42.06 28.94,41.78 U1.31
SCK  (via drill 0.3)
  Top 0.254: 34.79,33.73 U1.17 arc90 35.27,33.68 v36.42,33.68
  Bottom 0.254: ICSP.3 38.41,44.2 38.41,42.06 39.78,40.69 39.78,33.83 39.47,33.53 38.56,33.53 38.41,33.68 v36.42,33.68
THERM0  (via drill 0.3)
  Top 0.254: U1.28 31.34,39.87 v30.63,39.17 | v14.17,19.96 14.09,19.88 R4.2
  Top 0.61: HOTEND1.3 12.79,7.42 arc-45 12.98,7.87 C1.1 arc90 14.09,8.97 R4.2
  Bottom 0.254: v30.63,39.17 28.65,37.19 28.65,34.29 26.52,32.16 26.52,26.82 24.38,24.69 18.9,24.69 v14.17,19.96
THERM1  (via drill 0.3)
  Top 0.254: U1.27 32.14,39.6 v31.7,39.17 | v29.11,24.99 29.11,11.68 R8.2
  Top 0.61: R8.2 29.33,9.21 arc-45 C2.1 27.73,7.51 arc45 27.64,7.29 HOTEND2.3
  Bottom 0.254: v31.7,39.17 29.41,36.88 29.41,25.3 v29.11,24.99
THERM2  (via drill 0.3)
  Top 0.254: v46.02,36.73 45.41,37.34 44.35,37.34 40.54,41.15 36.27,41.15 35.51,41.91 33.07,41.91 32.94,41.78 U1.26 | v46.02,25.76 46.67,25.11 R12.2
  Top 0.61: R12.2 arc45 46.62,11.65 C3.1 44.12,6.55 arc45 44.03,6.33 HOTEND3.3
  Bottom 0.254: v46.02,36.73 v46.02,25.76
THERM3  (via drill 0.3)
  Top 0.254: U1.25 34.02,40.54 40.23,40.54 v43.43,37.34 | v64.31,21.49 64.31,14.78 63.26,13.73 R16.2 | v61.72,28.65 v43.89,28.65
  Top 0.61: HOTEND4.3 61.12,6.72 arc-45 61.21,6.95 C4.1
  Top 0.813: C4.1 63.19,11.39 R16.2
  Bottom 0.254: v43.89,28.65 43.89,36.88 v43.43,37.34 | v64.31,21.49 61.72,24.08 v61.72,28.65
THERM4  (via drill 0.3)
  Top 0.254: U1.24 39.62,39.33 v43.13,35.81 | v43.13,29.26 78.79,29.26 v79.25,28.8 | v79.25,27.28 79.25,11.81 R20.2
  Top 0.61: HOTEND5.3 77.27,6.19 arc-45 77.36,6.41 C5.1 79.62,8.93 R20.2
  Bottom 0.254: v79.25,28.8 v79.25,27.28 | v43.13,35.81 v43.13,29.26
THERM5  (via drill 0.3)
  Top 0.254: U1.23 39.35,38.52 v42.22,35.66 | v42.52,30.02 89.61,30.02 93.57,26.06 93.57,11.44 R24.2
  Top 0.61: HOTEND6.3 91.27,6.72 arc-45 91.36,6.94 C6.1 arc45 92.72,8.34 R24.2
  Bottom 0.254: v42.52,30.02 42.52,35.36 v42.22,35.66
TX
  Top 0.305: JP8.TXO 20.85,44.38 22.4,42.82 28.8,42.82 29.72,41.91 29.72,40.84 U1.30

### Text on the board
tPlace: DTR | RX | TX | +5V | NC | GND | GND | V+ | GND | V+ | Hotend TestBench / Marc Cobler - June 2015 / BCN3D Technologies / Fundacio CIM / ___________________ / v 1.0 - REV_A
bPlace: POWER RAILS | ERROR | ERROR | ERROR | ERROR | ERROR | ERROR | OK | OK | OK | OK | OK | OK | HOTEND1 | HOTEND2 | HOTEND3 | HOTEND4 | HOTEND5 | HOTEND6